# Altium schematic sheet USB_UART_BRIDGE.SchDoc
size A
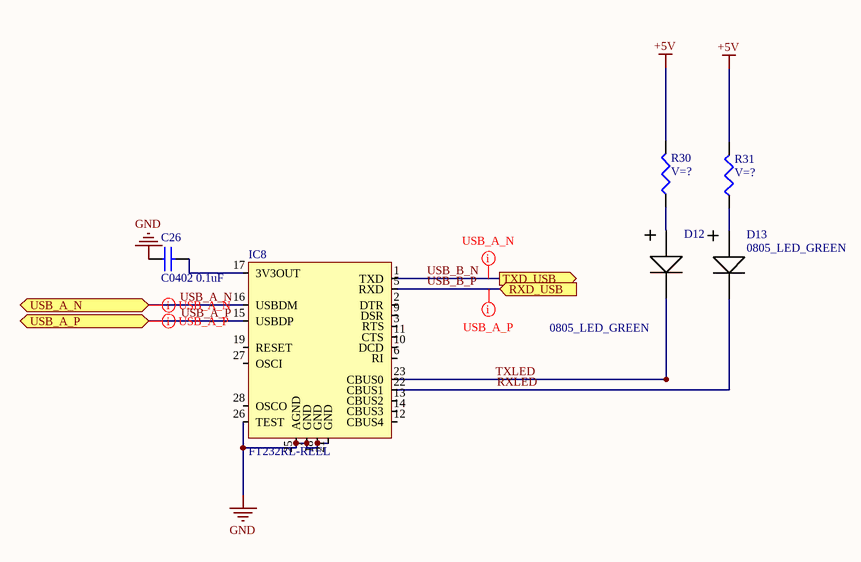
[diagram p0: USB_UART_BRIDGE.SchDoc]

## Parts
C26  C0402 0.1uF  [C0402]
D12  0805_LED_GREEN  [0805LED_GREEN]
D13  0805_LED_GREEN  [0805LED_GREEN]
IC8  FT232RL-REEL  [SSOP28]
R30  V=?  [r0402]
R31  V=?  [r0402]

## Ports
RXD_USB (in), TXD_USB (out), USB_A_N, USB_A_P

## Nets
+5V: R30.2 R31.2
GND: C26.1 IC8.7(GND) IC8.18(GND) IC8.21(GND) IC8.25(AGND) IC8.26(TEST)
RXLED: D13.1 IC8.22(CBUS1)
TXLED: D12.1 IC8.23(CBUS0)
USB_A_N: IC8.16(USBDM) ; port USB_A_N
USB_A_P: IC8.15(USBDP) ; port USB_A_P
USB_B_N: IC8.1(TXD) ; port TXD_USB
USB_B_P: IC8.5(RXD) ; port RXD_USB
NetC26_2: C26.2 IC8.17(3V3OUT)
NetD12_2: D12.2 R30.1
NetD13_2: D13.2 R31.1

Not connected (* = marked no-connect by the designer): IC8 2(DTR) 3(RTS) 6(RI) 9(DSR) 10(DCD) 11(CTS) 12(CBUS4) 13(CBUS2) 14(CBUS3) 19(RESET) 27(OSCI) 28(OSCO)

## Layout directives
differential pair; rule Differential Pairs Routing [Pref Gap = 6mil    Min Gap  = 6mil    Max Gap  = 6milPref Width = 9.5mil    Min Width  = 9.5mil    Max Width  = 9.5mil]; rule Differential Pairs Routing [Pref Gap = 6mil    Min Gap  = 6mil    Max Gap  = 6milPref Width = 9.5mil    Min Width  = 9.5mil    Max Width  = 9.5mil]: USB_A_N
differential pair; rule Differential Pairs Routing [Pref Gap = 6mil    Min Gap  = 6mil    Max Gap  = 6milPref Width = 9.5mil    Min Width  = 9.5mil    Max Width  = 9.5mil]; rule Differential Pairs Routing [Pref Gap = 6mil    Min Gap  = 6mil    Max Gap  = 6milPref Width = 9.5mil    Min Width  = 9.5mil    Max Width  = 9.5mil]; rule Differential Pairs Routing [Pref Gap = 6mil    Min Gap  = 6mil    Max Gap  = 6milPref Width = 9.5mil    Min Width  = 9.5mil    Max Width  = 9.5mil]: USB_A_P
differential pair; rule Differential Pairs Routing [Pref Gap = 6mil    Min Gap  = 6mil    Max Gap  = 6milPref Width = 9.5mil    Min Width  = 9.5mil    Max Width  = 9.5mil]: USB_B_N, USB_B_P

## Library data of the parts
C26 = C0402 0.1uF: CAP CER 0.1uF 16V X7R 0402 / SAMSUNG
D12 D13 = 0805_LED_GREEN: LGR971-KN OSRAM
IC8 = FT232RL-REEL: IC USB FS SERIAL UART 28-SSOP
R30 R31 = R0402: RESISTOR